# Altium project TB6612.PrjPcb
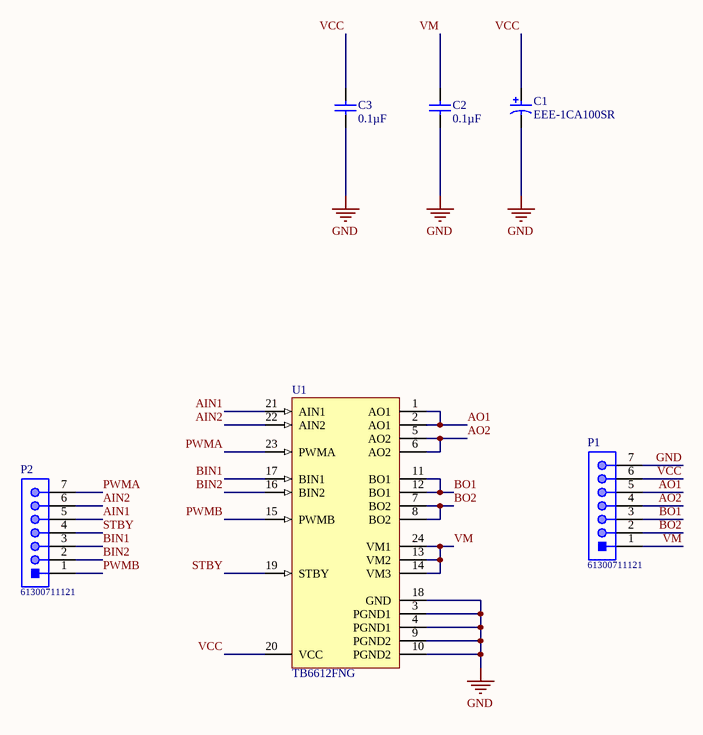
[diagram p0: SHC_TB6612FNG.SchDoc]
1 sheet, 6 parts. Net scope: global (net labels, ports and power ports of the same name join across sheets).
Board file: TB6612.PcbDoc

## Sheet SHC_TB6612FNG.SchDoc: TB6612FNG
size Letter; Revision: v1.0; SheetNumber: 1; SheetTotal: 1

### Parts
C1  EEE-1CA100SR  [PNSC-EEE1CA100SR_M]
C2  0.1µF  [CAPC2013X140X50ML20T25]
C3  0.1µF  [CAPC2013X140X50ML20T25]
P1  61300711121  [61300711121]
P2  61300711121  [61300711121]
U1  TB6612FNG  [TOSH-SSOP-24_M]

### Nets
GND: C1.2 C2.1 C3.1 P1.7 U1.3(PGND1) U1.4(PGND1) U1.9(PGND2) U1.10(PGND2) U1.18(GND)
AIN1: P2.5 U1.21(AIN1)
AIN2: P2.6 U1.22(AIN2)
AO1: P1.5 U1.1(AO1) U1.2(AO1)
AO2: P1.4 U1.5(AO2) U1.6(AO2)
BIN1: P2.3 U1.17(BIN1)
BIN2: P2.2 U1.16(BIN2)
BO1: P1.3 U1.11(BO1) U1.12(BO1)
BO2: P1.2 U1.7(BO2) U1.8(BO2)
PWMA: P2.7 U1.23(PWMA)
PWMB: P2.1 U1.15(PWMB)
STBY: P2.4 U1.19(STBY)
VCC: C1.1 C3.2 P1.6 U1.20(VCC)
VM: C2.2 P1.1 U1.13(VM2) U1.14(VM3) U1.24(VM1)

### Library data of the parts
C1 = CMP-2000-06199-1: Aluminum Electrolytic Capacitor, 10 uF, +/- 20%, -40 to 85 degC, 2-Pin SMD, RoHS, Tape and Reel; Manufacturer: Panasonic; Lead Length: 1.8mm; No. of Pins: 2; Ripple Current Frequency: 120Hz; Ripple Current Temperature: 85°C; External Depth: 4.3mm; Operating Lifetime: 2000h; Power Factor: 0.16; Lead Cross-section Width: 0.65mm; Product Range: PANASONIC-SSeries; Voltage Rating V DC: 16V; Leakage Current: 3µA; Ripple Current AC: 28mA; AE Capacitor Case: RadialCan-SMD; Capacitance: 10µF; Lifetime @ Temperature: 2000hours@85°C; External Length / Height: 5.4mm; SVHC: NoSVHC(16-Dec-2013); Packaging: CutTape; Series: VS; Package Description: 2-Pin Surface Mount Device, Body 4.5 x 4.5 mm; Tolerance -: 20%; Capacitor Terminals: SMD; Lead Spacing: 1mm; Package / Case: B; Capacitance Tolerance: ±20%; Operating life Time: 2000h; Tape Width: 12mm; Power Factor Frequency: 120Hz; Voltage Rating: 16V; Diameter: 4mm; Operating Temperature Max: 85°C; Datasheet URL: https://datasheet.ciiva.com/19458/1355487-19458346.pdf; Capacitor Mounting: SMD; External Width: 4.3mm; Operating Life Temperature: 85°C; Capacitance Tolerance ±: ±20%; Package Reference: EEE1CA100SR; AC Ripple Current: 28mA; Tolerance +: 20%; Height: 5.4mm; Datasheet Version: 04/2005; Operating Temperature Min: -40°C; Capacitor Case Style: RadialCan-SMD; Mounting Technology: SurfaceMount; Operating Temperature Range: -40°Cto+85°C; Manufacturer URL: http://www.panasonic.com/; Life Time @ Temperature: 2000hours@85°C
C2 C3 = CMP-2007-03242-1: 10µF ±10% 16V Ceramic Capacitor X5R 0805 (2012 Metric); Part Number: CL21A106KOQNNNG
P1 P2 = CMP-1502-01074-1: THT Vertical Pin Header WR-PHD, Pitch 2.54 mm, Single Row, 7 pins; Manufacturer: Wurth Elektronik; Pin Number: 7; Gender: Male; Working Voltage: 250VAC; Contact Resistance: 20mOhm; Rated Current: 3A; Pitch: 2.54mm; Withstanding Voltage: 500VAC; Row Number: Single; Packaging: Bag; Orientation: Vertical; Manufacturer URL: http://www.we-online.de; Datasheet URL: https://katalog.we-online.de/em/datasheet/6130xx11121.pdf; Part Number: 61300711121; Publisher: WurthElektronik; Operating Temperature: -40to105degC; Mounting Technology: THT; Package Reference: 61300711121
U1 = CMP-1773-00001-1: Driver IC for Dual DC Motor, 15 V, -20 to 85 degC, 24-Pin SSOP, RoHS, Tape and Reel; Elements: 2; Max Power Dissipation: 200 mW; Max Surge Current: 100 mA; Element Configuration: Common Cathode; Case\Package: TO-236-3; Forward Voltage: 1 V; Peak Reverse Current: 0.1 uA; Forward Current: 70 mA; Recovery Time: 5 ns; Radiation Hardening: No; Packaging: Tape and Reel; ComponentLink2Description: Datasheet; REACH SVHC: No SVHC; ComponentLink2URL: https://toshiba.semicon-storage.com/info/docget.jsp?did=10660&prodName=TB6612FNG; RoHSCompliant: true; DatasheetVersion: Oct-14; PackageDescription: 24-Pin Shrink Small Outline Package Integrated Circuit, Body 7.8 x 5.6 mm, Pitch 0.65 mm; Package Quantity: 3000; Length: 3 mm; Pins: 3; Mount: Surface Mount; ComponentLink1Description: Manufacturer URL; PackageReference: SSOP-24; ComponentLink1URL: http://www.toshiba.com/; Width: 1.4 mm; Max Operating Temperature: 125 degC; Height: 1.1 mm; Min Operating Temperature: -55 degC